# EAGLE design octo_driver (EAGLE 6.4)
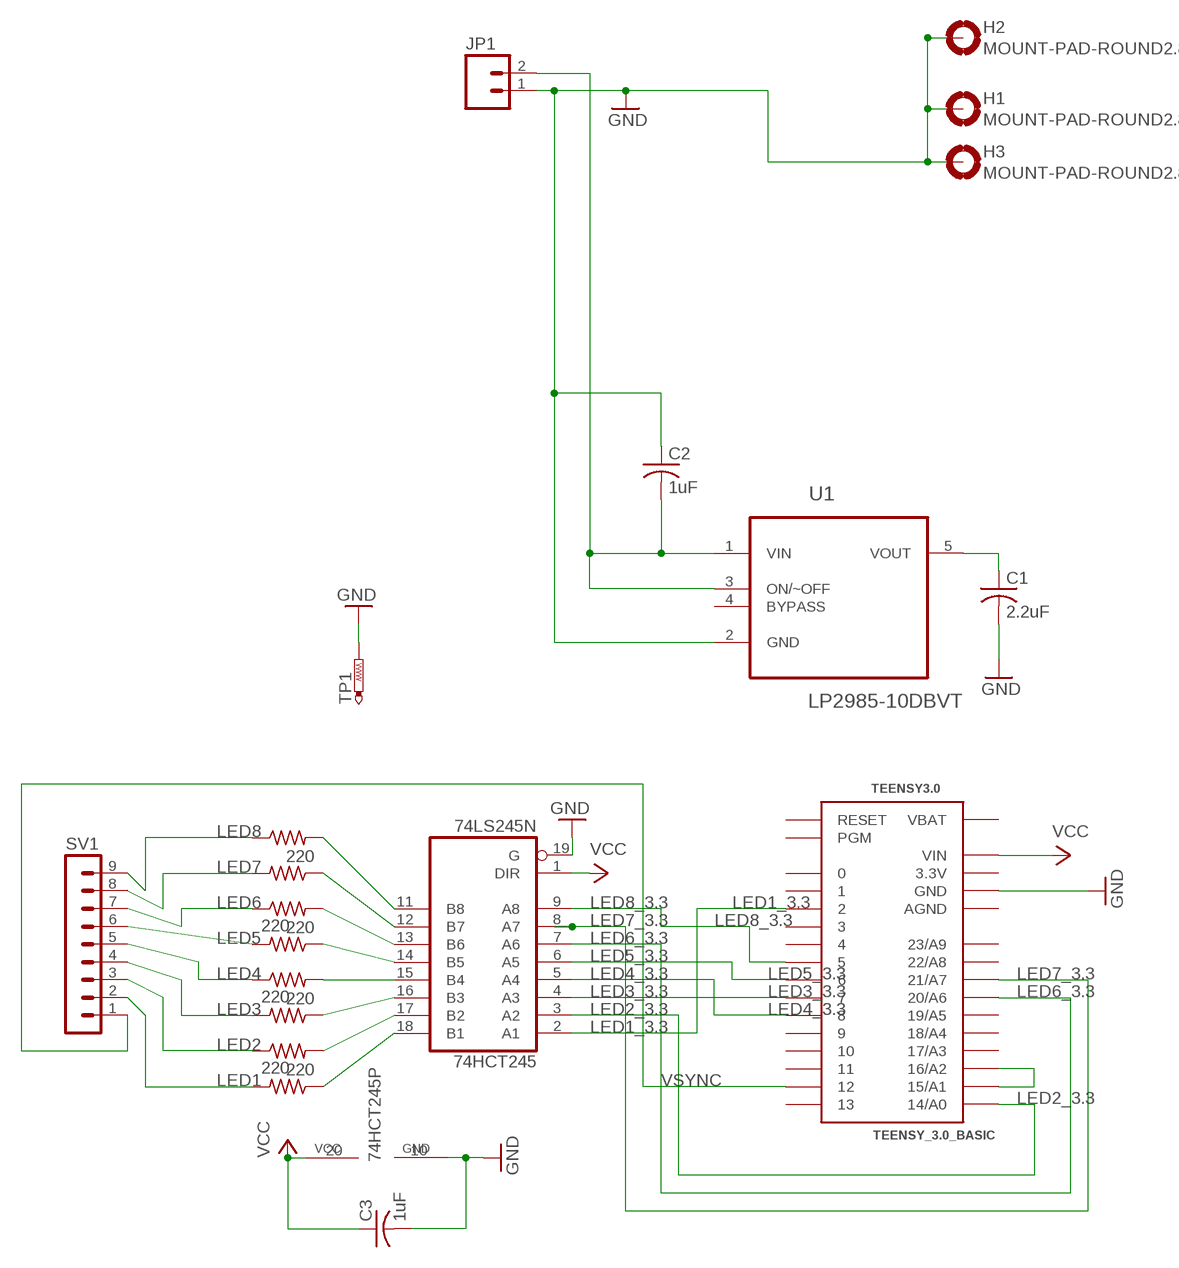
[diagram p0: schematic, sheet 1]

## Parts
74HCT245  74LS245N  [DIL20]
C1  2.2uF  C-USC0805  [C0805]
C2  1uF  C-USC0805  [C0805]
C3  1uF  C-USC0805  [C0805]
H1  MOUNT-PAD-ROUND2.8  [2,8-PAD]
H2  MOUNT-PAD-ROUND2.8  [2,8-PAD]
H3  MOUNT-PAD-ROUND2.8  [2,8-PAD]
JP1  M02PTH  [1X02]
RLED1  220  R-US_R0805  [R0805]
RLED8  220  R-US_R0805  [R0805]
RLED9  220  R-US_R0805  [R0805]
RLED10  220  R-US_R0805  [R0805]
RLED11  220  R-US_R0805  [R0805]
RLED12  220  R-US_R0805  [R0805]
RLED13  220  R-US_R0805  [R0805]
RLED14  220  R-US_R0805  [R0805]
SV1  MA09-1  [MA09-1]
TEENSY3.0  TEENSY_3.0_BASIC  [TEENSY_3.0_BASIC]
TP1  PTR1B2,54  [B2,54]
U1  LP2985-10DBVT  [SOT95P280X145-5N]

## Nets
GND: 74HCT245.10(GND) 74HCT245.19(G) C1.2 C2.1 C3.2 H1.B2,8(MOUNT) H2.B2,8(MOUNT) H3.B2,8(MOUNT) JP1.1 TEENSY3.0.GND TEENSY3.0.GND1(GND) TP1.TP U1.2(GND)
LED1: RLED14.2 SV1.2
LED1_3.3: 74HCT245.2(A1) TEENSY3.0.2
LED2: RLED13.1 SV1.3
LED2_3.3: 74HCT245.3(A2) TEENSY3.0.14/A0
LED3: RLED12.2 SV1.4
LED3_3.3: 74HCT245.4(A3) TEENSY3.0.7
LED4: RLED11.1 SV1.5
LED4_3.3: 74HCT245.5(A4) TEENSY3.0.8
LED5: RLED10.2 SV1.6
LED5_3.3: 74HCT245.6(A5) TEENSY3.0.6
LED6: RLED9.1 SV1.7
LED6_3.3: 74HCT245.7(A6) TEENSY3.0.20/A6
LED7: RLED8.2 SV1.8
LED7_3.3: 74HCT245.8(A7) TEENSY3.0.21/A7
LED8: RLED1.1 SV1.9
LED8_3.3: 74HCT245.9(A8) TEENSY3.0.5
N$1: C2.2 JP1.2 U1.1(VIN) U1.3(ON/~OFF)
N$2: C1.1 U1.5(VOUT)
N$3: TEENSY3.0.15/A1 TEENSY3.0.16/A2
N$16: 74HCT245.11(B8) RLED1.2
N$17: 74HCT245.12(B7) RLED8.1
N$19: 74HCT245.13(B6) RLED9.2
N$20: 74HCT245.14(B5) RLED10.1
N$21: 74HCT245.15(B4) RLED11.2
N$22: 74HCT245.16(B3) RLED12.1
N$23: 74HCT245.17(B2) RLED13.2
N$24: 74HCT245.18(B1) RLED14.1
VCC: 74HCT245.1(DIR) 74HCT245.20(VCC) C3.1 TEENSY3.0.VIN
VSYNC: SV1.1 TEENSY3.0.12
Unconnected: TEENSY3.0.0 TEENSY3.0.1 TEENSY3.0.3 TEENSY3.0.4 TEENSY3.0.9 TEENSY3.0.10 TEENSY3.0.11 TEENSY3.0.13 TEENSY3.0.17/A3 TEENSY3.0.18/A4 TEENSY3.0.19/A5 TEENSY3.0.22/A8 TEENSY3.0.23/A9 TEENSY3.0.PGM TEENSY3.0.RESET U1.4(BYPASS)

## Power pins joined to a net without a drawn wire
3.3V: TEENSY3.0.3.3V TEENSY3.0.3.3V1(3.3V)
AGND: TEENSY3.0.AGND
VBAT: TEENSY3.0.VBAT

## Library data of the parts
74HCT245 = 74xx-us:74*245: Octal BUS TRANSCEIVER, 3-state
C1-C3 = rcl:C-US: CAPACITOR, American symbol
H1-H3 = holes:MOUNT-PAD-ROUND: MOUNTING PAD, round
JP1 = SparkFun-Connectors:M02: Header 2 Standard 2-pin 0.1" header. Use with straight break away headers (SKU : PRT-00116), right angle break away headers (PRT-00553), swiss pins (PRT-00743), machine pins (PRT-00117), and female headers (PRT-00115). Molex polarized connector foot print use with SKU : PRT-08233 with associated crimp pins and housings.
RLED1 RLED8-RLED14 = rcl:R-US_: RESISTOR, American symbol
SV1 = penrose-con-lstb:MA09-1: PIN HEADER; OC_FARNELL: unknown; OC_NEWARK: unknown
TEENSY3.0 = Teensy3.0:TEENSY_3.0_BASIC: Basic Teensy 3.0 with none of the 'inner' pins enabled. See '+4', 'AllAnalogPins", and 'AllPins' packages for additional pin holes, as needed.
TP1 = testpad:PTR1: TEST PIN
U1 = Texas Instruments_By_element14_Batch_1:LP2985-10DBVT: LOW-DROPOUT REGULATOR; MPN: LP2985-10DBVT; OC_FARNELL: -; OC_NEWARK: 24R9589; PACKAGE: SOT-5; SUPPLIER: Texas Instruments

## Board
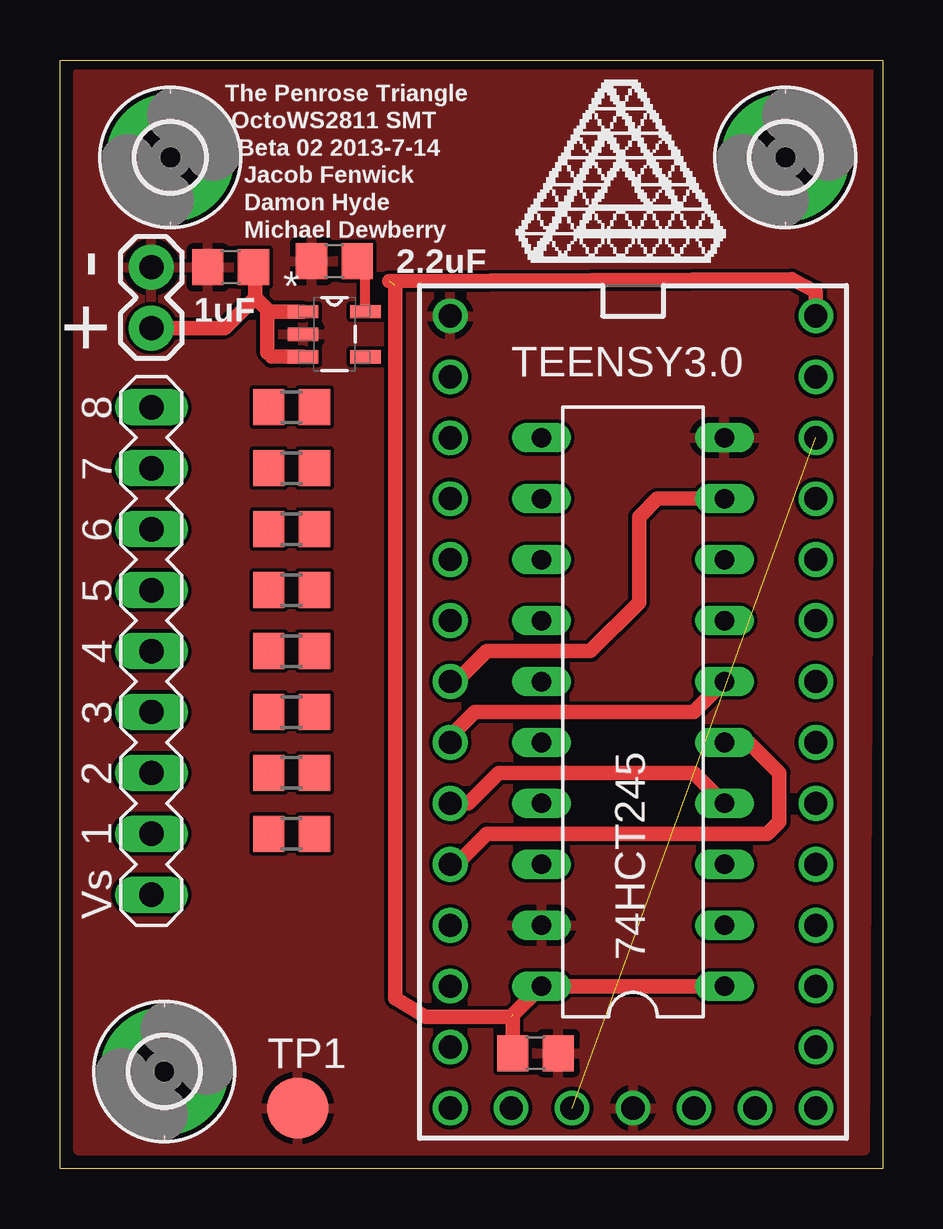
[diagram p1: board, top side]
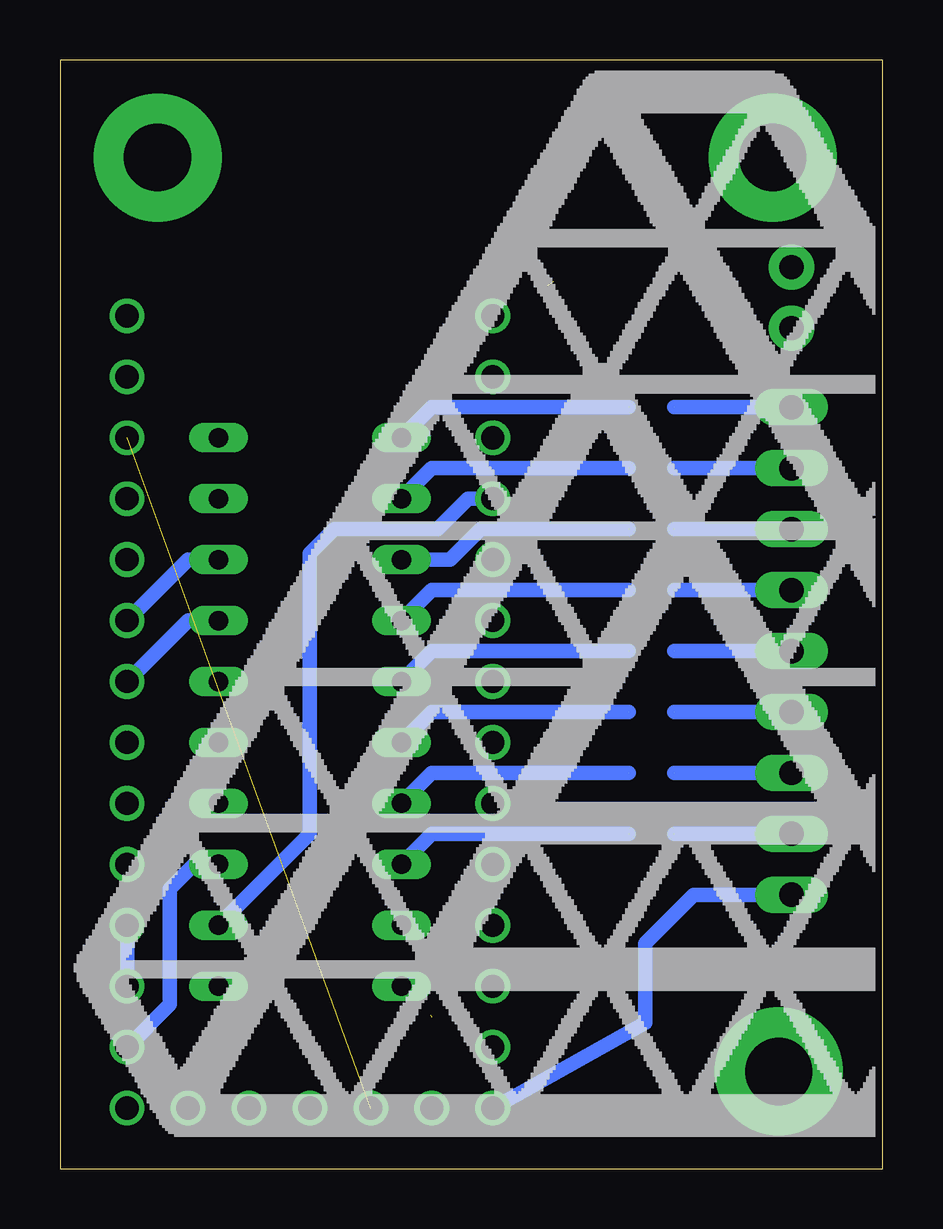
[diagram p2: board, bottom side, seen from below]

Size 34.29 x 46.23 mm. Coordinates in mm from the lower left corner, seen from the top.
Outline: 0,46.23 34.29,46.23 34.29,0 0,0 0,46.23
Copper layers (1*16): Top 0.0356mm / dielectric 1.5011mm / Bottom 0.0356mm
Design rules "LaenPCBOrder": minimum track width 6mil, minimum drill 13mil, track to track 6mil, track to pad 6mil, pad to pad 6mil, via to via 6mil, smd to smd 6mil, copper to edge 15mil, drill to drill 6mil, minimum pad ring 7mil, minimum via ring 7mil, stop-mask expansion 4mil, vias tented up to drill 0mil, thermal gap 10mil

### Footprints (pad centres in the part's own frame; a part is rotated, then mirrored left to right if it is on the bottom)
DIL20 = drill 0.813 long: 1 -11.43,-3.81; 2 -8.89,-3.81; 3 -6.35,-3.81; 4 -3.81,-3.81; 5 -1.27,-3.81; 6 1.27,-3.81; 7 3.81,-3.81; 8 6.35,-3.81; 9 8.89,-3.81; 10 11.43,-3.81; 11 11.43,3.81; 12 8.89,3.81; 13 6.35,3.81; 14 3.81,3.81; 15 1.27,3.81; 16 -1.27,3.81; 17 -3.81,3.81; 18 -6.35,3.81; 19 -8.89,3.81; 20 -11.43,3.81
C0805 = smd 1.3 x 1.5: 1 -0.95,0; 2 0.95,0
2,8-PAD = drill 2.8 pad 5.334: B2,8 0,0
1X02 = drill 1.016 pad 1.88: 1 0,0; 2 2.54,0
R0805 = smd 1.3 x 1.5: 1 -0.95,0; 2 0.95,0
MA09-1 = drill 1.016 long: 1 -10.16,0; 2 -7.62,0; 3 -5.08,0; 4 -2.54,0; 5 0,0; 6 2.54,0; 7 5.08,0; 8 7.62,0; 9 10.16,0
TEENSY_3.0_BASIC = drill 0.965: 0 -7.62,13.97; 1 -7.62,11.43; 2 -7.62,8.89; 3 -7.62,6.35; 3.3V 7.62,11.43; 3.3V1 -2.54,-16.51; 4 -7.62,3.81; 5 -7.62,1.27; 6 -7.62,-1.27; 7 -7.62,-3.81; 8 -7.62,-6.35; 9 -7.62,-8.89; 10 -7.62,-11.43; 11 -7.62,-13.97; 12 -7.62,-16.51; 13 7.62,-16.51; 14/A0 7.62,-13.97; 15/A1 7.62,-11.43; 16/A2 7.62,-8.89; 17/A3 7.62,-6.35; 18/A4 7.62,-3.81; 19/A5 7.62,-1.27; 20/A6 7.62,1.27; 21/A7 7.62,3.81; 22/A8 7.62,6.35; 23/A9 7.62,8.89; AGND 7.62,13.97; GND -7.62,16.51; GND1 0,-16.51; PGM 2.54,-16.51; RESET 5.08,-16.51; VBAT -5.08,-16.51; VIN 7.62,16.51
B2,54 = smd 2.54 x 2.54: TP 0,0
SOT95P280X145-5N = smd 1.27 x 0.559: 1 -1.295,0.94; 2 -1.295,0; 3 -1.295,-0.94; 4 1.295,-0.94; 5 1.295,0.94

### Placement (x,y rotation side)
74HCT245  23.88,19.05 90 top
C1  11.43,37.85 180 top
C2  7.11,37.59 0 top
C3  19.81,4.83 0 top
H1  4.34,4.06 0 top
H2  4.6,42.16 0 top
H3  30.23,42.16 0 top
JP1  3.81,37.59 270 top
RLED1  9.65,31.75 0 top
RLED8  9.65,29.21 180 top
RLED9  9.65,26.67 0 top
RLED10  9.65,24.13 180 top
RLED11  9.65,21.59 0 top
RLED12  9.65,19.05 180 top
RLED13  9.65,16.51 0 top
RLED14  9.65,13.97 180 top
SV1  3.81,21.59 90 top
TEENSY3.0  23.88,19.05 0 top
TP1  9.91,2.54 0 top
U1  11.43,34.8 0 top
U$1  [PENROSELOGO_LOWDPI]  23.37,40.89 0 top
U$2  [PENROSELOGO_1.75IN]  8.13,20.32 0 top

### Tracks (layer width: path | path; a pad name or v marks a point on that pad's centre or on a via)
3.3V  (1 unrouted)
GND
  pour Top: 33.78,45.72 33.53,0.76 0.76,0.76 0.76,45.72
LED1  (1 unrouted)
  Bottom 0.61: RLED14.2 SV1.2
LED1_3.3
  Bottom 0.61: TEENSY3.0.2 17.27,27.94 18.54,26.67 22.86,26.67 23.88,25.65 23.88,13.97 74HCT245.2
LED2  (1 unrouted)
  Bottom 0.61: SV1.3 RLED13.1
LED2_3.3
  Bottom 0.61: 74HCT245.3 28.7,12.7 29.72,11.68 29.72,6.86 TEENSY3.0.14/A0
LED3  (1 unrouted)
  Bottom 0.61: RLED12.2 SV1.4
LED3_3.3
  Top 0.61: TEENSY3.0.7 17.02,15.24 18.29,16.51 26.42,16.51 74HCT245.4
LED4  (1 unrouted)
  Bottom 0.61: SV1.5 RLED11.1
LED4_3.3
  Top 0.61: TEENSY3.0.8 16.51,12.7 17.78,13.97 29.46,13.97 29.97,14.48 29.97,16.51 28.7,17.78 74HCT245.5
LED5  (1 unrouted)
  Bottom 0.61: RLED10.2 SV1.6
LED5_3.3
  Top 0.61: TEENSY3.0.6 16.26,18.03 17.27,19.05 26.42,19.05 74HCT245.6
LED6  (1 unrouted)
  Bottom 0.61: SV1.7 RLED9.1
LED6_3.3
  Bottom 0.61: 74HCT245.7 28.96,22.86 TEENSY3.0.20/A6
LED7  (1 unrouted)
  Bottom 0.61: RLED8.2 SV1.8
LED7_3.3
  Bottom 0.61: 74HCT245.8 28.96,25.4 TEENSY3.0.21/A7
LED8  (1 unrouted)
  Bottom 0.61: SV1.9 RLED1.1
LED8_3.3
  Top 0.61: TEENSY3.0.5 16.51,20.32 17.78,21.59 22.1,21.59 24.13,23.62 24.13,27.18 24.89,27.94 74HCT245.9
N$1
  Top 0.406: 8.13,37.53 C2.2 | 8.81,33.86 8.64,34.04 | 8.64,35.66 8.71,35.74
  Top 0.61: JP1.2 6.86,35.05 8.13,36.32 | 8.13,36.32 8.13,37.53 | U1.1 8.71,35.74 8.13,36.32 | U1.3 8.81,33.86 | 8.64,34.04 8.64,35.66
N$2
  Top 0.406: U1.5 12.73,37.5 C1.1
N$3
  Bottom 0.61: TEENSY3.0.15/A1 TEENSY3.0.16/A2
N$16  (1 unrouted)
  Bottom 0.61: RLED1.2 18.8,31.75 74HCT245.11
N$17  (1 unrouted)
  Bottom 0.61: RLED8.1 18.8,29.21 74HCT245.12
N$19  (1 unrouted)
  Bottom 0.61: RLED9.2 16.76,26.67 18.03,25.4 74HCT245.13
N$20  (1 unrouted)
  Bottom 0.61: RLED10.1 18.8,24.13 74HCT245.14
N$21  (1 unrouted)
  Bottom 0.61: RLED11.2 18.8,21.59 74HCT245.15
N$22  (1 unrouted)
  Bottom 0.61: RLED12.1 18.8,19.05 74HCT245.16
N$23  (1 unrouted)
  Bottom 0.61: RLED13.2 18.8,16.51 74HCT245.17
N$24  (1 unrouted)
  Bottom 0.61: RLED14.1 18.8,13.97 74HCT245.18
VCC  (2 unrouted)
  Top 0.61: C3.1 18.86,6.42 74HCT245.20 74HCT245.1 | 13.72,37.01 30.48,37.08 31.5,36.58 TEENSY3.0.VIN | 13.97,36.83 13.97,7.11 15.24,6.35 18.8,6.35
VSYNC
  Bottom 0.61: TEENSY3.0.12 9.91,6.1 9.91,9.4 7.87,11.43 SV1.1

### Text on the board
tNames: The Penrose Triangle / OctoWS2811 SMT / Beta 02 2013-7-14 / Jacob Fenwick / Damon Hyde / Michael Dewberry | + -